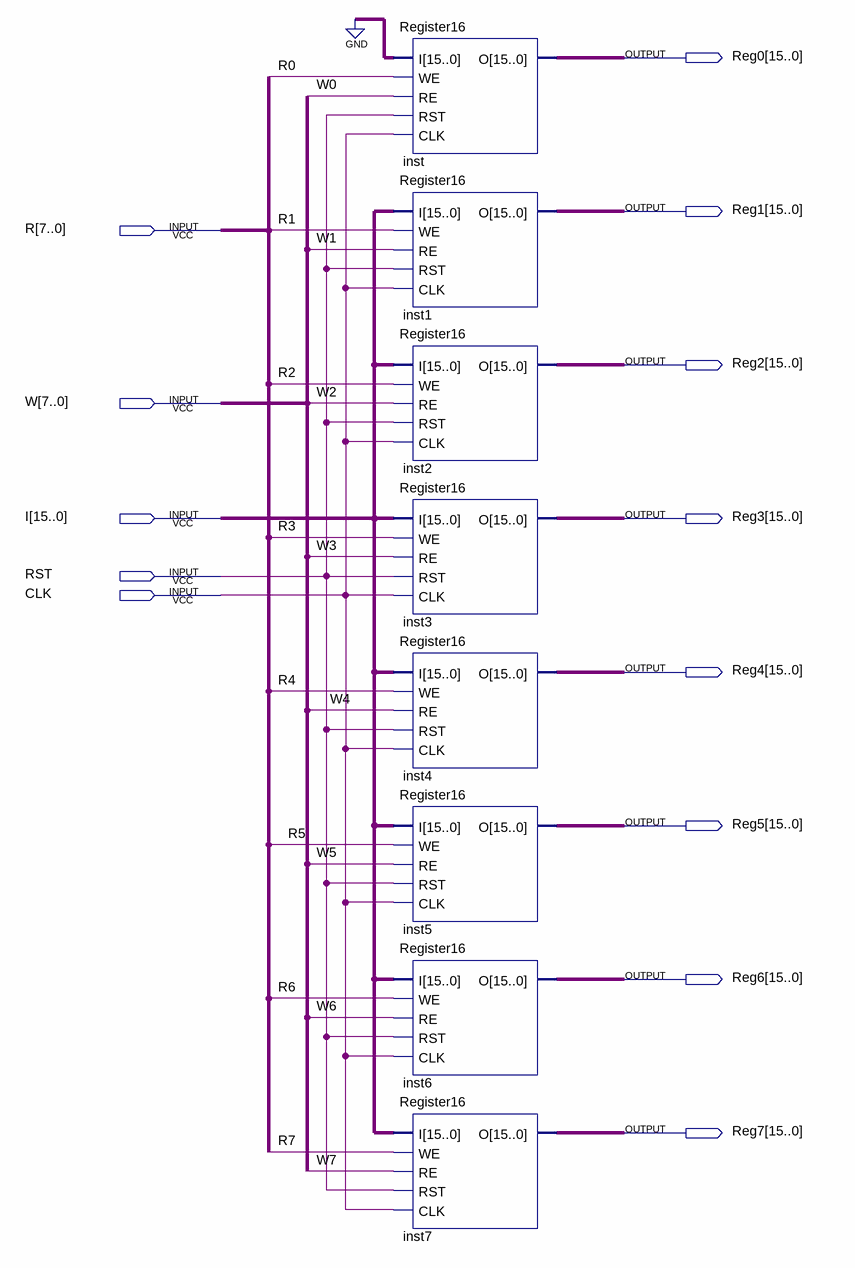
[diagram p0: schematic sheet]
// Quartus schematic RF8x16.bdf as structural Verilog: 8 symbols, 13 pins
module RF8x16 (
  input  [7:0] R,
  input  [7:0] W,
  input  [15:0] I,
  input  RST,
  input  CLK,
  output [15:0] Reg0,
  output [15:0] Reg1,
  output [15:0] Reg2,
  output [15:0] Reg3,
  output [15:0] Reg4,
  output [15:0] Reg5,
  output [15:0] Reg6,
  output [15:0] Reg7
);

  Register16 inst (.I({16{1'b0}}), .WE(R[0]), .RE(W[0]), .RST(RST), .CLK(CLK), .O(Reg0));
  Register16 inst1 (.I(I), .WE(R[1]), .RE(W[1]), .RST(RST), .CLK(CLK), .O(Reg1));
  Register16 inst2 (.I(I), .WE(R[2]), .RE(W[2]), .RST(RST), .CLK(CLK), .O(Reg2));
  Register16 inst3 (.I(I), .WE(R[3]), .RE(W[3]), .RST(RST), .CLK(CLK), .O(Reg3));
  Register16 inst4 (.I(I), .WE(R[4]), .RE(W[4]), .RST(RST), .CLK(CLK), .O(Reg4));
  Register16 inst5 (.I(I), .WE(R[5]), .RE(W[5]), .RST(RST), .CLK(CLK), .O(Reg5));
  Register16 inst6 (.I(I), .WE(R[6]), .RE(W[6]), .RST(RST), .CLK(CLK), .O(Reg6));
  Register16 inst7 (.I(I), .WE(R[7]), .RE(W[7]), .RST(RST), .CLK(CLK), .O(Reg7));
endmodule
